# Altium schematic sheet 05 RFID.SchDoc
size A
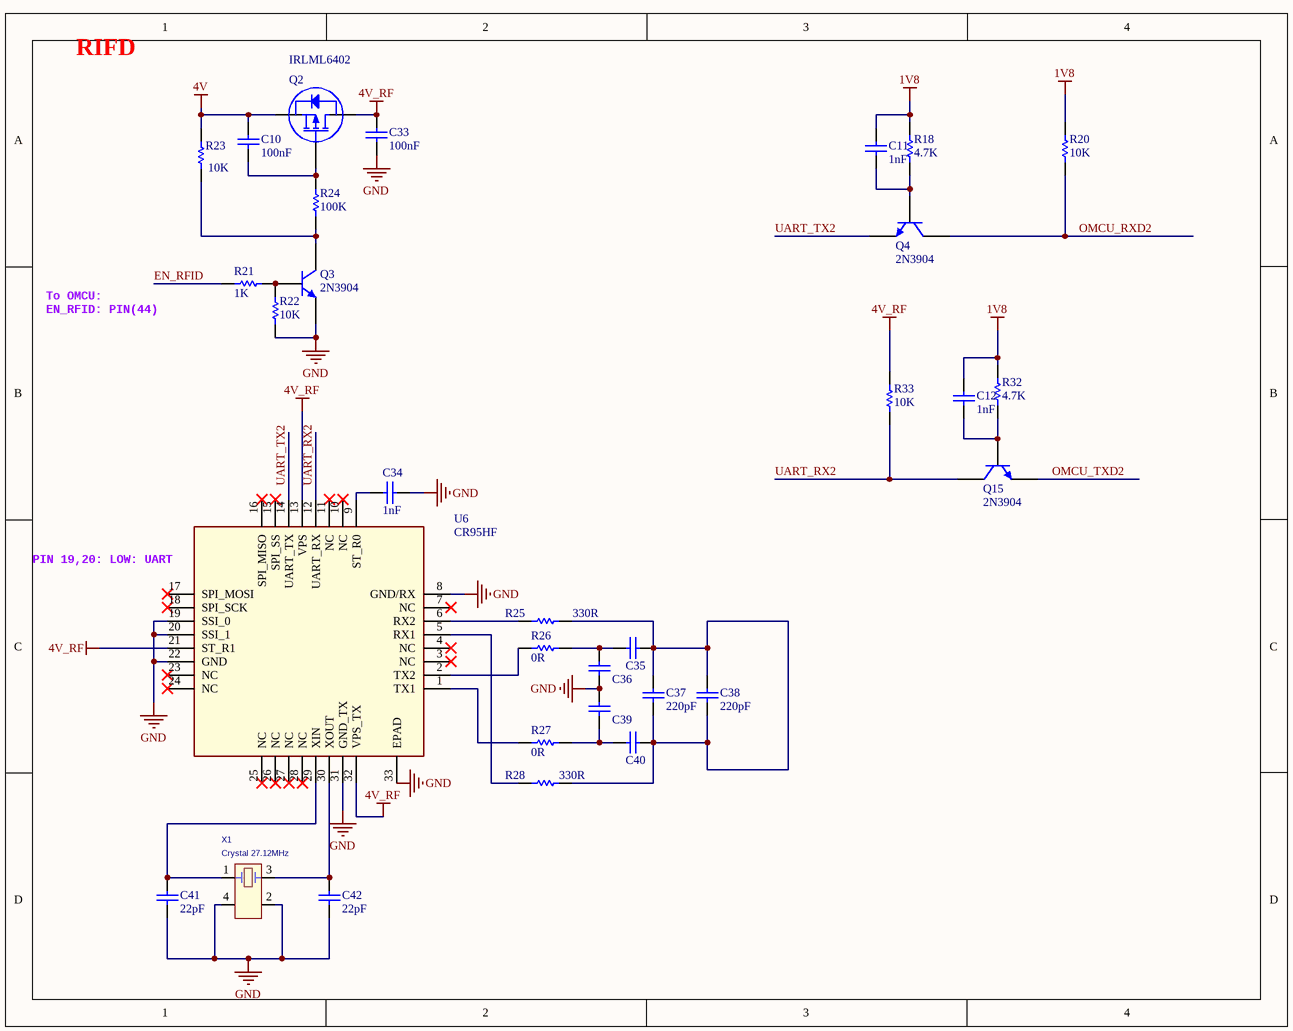
[diagram p0: 05 RFID.SchDoc]

## Parts
C10  100nF  [0603 - C]
C11  1nF  [0603 - C]
C12  1nF  [0603 - C]
C33  100nF  [0603 - C]
C34  1nF  [0603 - C]
C35  150pF  [0603 - C]  (value not drawn)
C36  150pF  [0603 - C]  (value not drawn)
C37  220pF  [0603 - C]
C38  220pF  [0603 - C]
C39  150pF  [0603 - C]  (value not drawn)
C40  150pF  [0603 - C]  (value not drawn)
C41  22pF  [0603 - C]
C42  22pF  [0603 - C]
Q2  IRLML6402  [SOT23B]
Q3  2N3904  [SOT23B]
Q4  2N3904  [SOT23B]
Q15  2N3904  [SOT23B]
R18  4.7K  [0603 - R]
R20  10K  [0603 - R]
R21  1K  [0603 - R]
R22  10K  [0603 - R]
R23  10K  [0603 - R]
R24  100K  [0603 - R]
R25  330R  [0603 - R]
R26  0R  [0603 - R]
R27  0R  [0603 - R]
R28  330R  [0603 - R]
R32  4.7K  [0603 - R]
R33  10K  [0603 - R]
U6  CR95HF  [32-VFQFN]
X1  Crystal 27.12MHz  [Crystal 2016]

## Nets
1V8: C11.2 C12.2 R18.2 R20.2 R32.2
4V: C10.2 Q2.2(S) R23.2
4V_RF: C33.2 Q2.3(D) R33.2 U6.13(VPS) U6.21(ST_R1) U6.32(VPS_TX)
GND: C33.1 C34.2 C36.1 C39.2 C41.1 C42.1 Q3.2(E) R22.1 U6.8(GND/RX) U6.19(SSI_0) U6.20(SSI_1) U6.22(GND) U6.31(GND_TX) U6.33(EPAD) X1.2(GND) X1.4(GND)
EN_RFID: R21.1
OMCU_RXD2: Q4.3(C) R20.1
OMCU_TXD2: Q15.2(E)
UART_RX2: Q15.3(C) R33.1 U6.12(UART_RX)
UART_TX2: Q4.2(E) U6.14(UART_TX)
NetC10_1: C10.1 Q2.1(G) R24.2
NetC11_1: C11.1 Q4.1(B) R18.1
NetC12_1: C12.1 Q15.1(B) R32.1
NetC34_1: C34.1 U6.9(ST_R0)
NetC35_1: C35.1 C36.2 R26.2
NetC35_2: C35.2 C37.1 C37.2 C38.1 C38.2 C40.2 R25.2 R28.2
NetC39_1: C39.1 C40.1 R27.2
NetC41_2: C41.2 U6.29(XIN) X1.1(OSC1)
NetC42_2: C42.2 U6.30(XOUT) X1.3(OSC2)
NetQ3_1: Q3.1(B) R21.2 R22.2
NetQ3_3: Q3.3(C) R23.1 R24.1
NetR25_1: R25.1 U6.6(RX2)
NetR26_1: R26.1 U6.2(TX2)
NetR27_1: R27.1 U6.1(TX1)
NetR28_1: R28.1 U6.5(RX1)

Not connected (* = marked no-connect by the designer): U6 3(NC)* 4(NC)* 7(NC)* 10(NC)* 11(NC)* 15(SPI_SS)* 16(SPI_MISO)* 17(SPI_MOSI)* 18(SPI_SCK)* 23(NC)* 24(NC)* 25(NC)* 26(NC)* 27(NC)* 28(NC)*

## Notes on the sheet
- RIFD
- To OMCU:
- EN_RFID: PIN(44)
- (near U6) PIN 19,20: LOW: UART

## Library data of the parts
C10 C33 = Cap 0603 100nF: CAP CER 100nF 50V C0G/NP0 0603; MPN: CL10C104JB8NNNC; MFR: SAMSUNG; Company ID: VT_CAP_C0603 100nF; Voltage: 50V; Package: 0603; Size: C0603: 100nF; Value: 100nF
C11 C12 = Cap 0603 1nF: CAP CER 1000PF 50V C0G/NP0 0603; MPN: CL10C102JB8NNNC; MFR: SAMSUNG; Company ID: VT_CAP_C0603 1nF; Size: C0603: 1nF; Value: 1nF
C34 = Cap 0603 1nF: CAP CER 1000PF 50V C0G/NP0 0603; MPN: CL10C102JB8NNNC; MFR: SAMSUNG; Company ID: VT_TỤ ĐIỆN_C0603 1nF; Size: C0603: 1nF; Value: 1nF
C35 C36 C39 C40 = Cap 0603 150pF: CAP CER 150PF 50V C0G/NP0 0603; MPN: CL10C151JB8NNNC; MFR: SAMSUNG; Company ID: VT_TỤ ĐIỆN_C0603 150pF; Value: 150pF; Size: C0603: 150pF
C37 C38 = Cap 0603 220pF: CAP CER 220PF 50V C0G/NP0 0603; MPN: CL10C221JB8NNNC; MFR: SAMSUNG; Company ID: VT_TỤ ĐIỆN_C0603 220pF; Value: 220pF; Size: C0603: 220pF
C41 C42 = Cap 0603 22pF: CAP CER 22PF 50V C0G/NP0 0603; MPN: CL10C220JB8NNNC; MFR: SAMSUNG; Company ID: VT_TỤ ĐIỆN_C0603 22pF; Value: 22pF; Size: C0603: 22pF
Q2 = IRLML6402TRPBF: MOSFET P-CH 30V 3.6A SOT-23-3; MFR: Infineon Technologies; Categories: TRANSISTOR; MPN: IRLML6402TRPBF
Q3 Q4 Q15 = Transistor 2N3904: TRANS NPN 40V 0.2A SOT-23; MPN: MMBT3904; MFR: Fairchild; Company ID: VT_TRANSISTOR_3904
R18 R32 = Res 0603 4.7K: RES SMD 4.7K OHM 1% 1/10W 0603; MFR: Yageo; MPN: RC0603FR-074K7L; Company ID: VT_RES_R0603 4.7K; Size: R0603: 4.7K; Value: 4.7K
R20 R23 R33 = Res 0603 10K: RES SMD 10K OHM 1% 1/10W 0603; MFR: Yageo; MPN: RC0603FR-0710KL; Company ID: VT_RES_R0603 10K; Size: R0603: 10K; Value: 10K
R21 = Res 0603 1K: RES SMD 1K OHM 1% 1/10W 0603; MFR: Yageo; MPN: RC0603FR-071KL; Company ID: VT_RES_R0603 1K; Size: R0603: 1K; Value: 1K
R22 = Res 0603 10K: RES SMD 10K OHM 1% 1/10W 0603; MFR: Yageo; MPN: RC0603FR-0710KL; Company ID: VT_ĐIỆN TRỞ_R0603 10K; Value: 10K; Size: R0603: 10K
R24 = Res 0603 100K: RES SMD 100K OHM 1% 1/10W 0603; MFR: Yageo; MPN: RC0603FR-07100KL; Company ID: VT_RES_R0603 100K; Size: R0603: 100K; Value: 100K
R25 R28 = Res 0603 330R: RES SMD 330OHM 1% 1/10W 0603; MFR: Yageo; MPN: RC0603FR-07330RL; Company ID: VT_ĐIỆN TRỞ_R0603 330R; Value: 330R; Size: R0603: 330R
R26 R27 = Res 0603 0R: RES SMD 0 OHM JUMPER 1/10W 0603; MFR: Yageo; MPN: RC0603FR-070RL; Company ID: VT_ĐIỆN TRỞ_R0603 0R; Size: R0603: 0R; Value: 0R
U6 = CR95HF: IC RFID RDR/TRN 13.56MZ 32VFQFPN; MPN: CR95HF-VMD5T; MFR: ST; Company ID: VT_IC_CR95HF
X1 = XTAL-XRCBG27M: CRYSTAL 27.12MHz RoHS; MPN: XRCGB27M120F3M00R0; MFR: Murata; Company ID: VT_CRYSTAL_SMD 27.12MHz